# EAGLE schematic power distribution pcb (EAGLE 6.2)
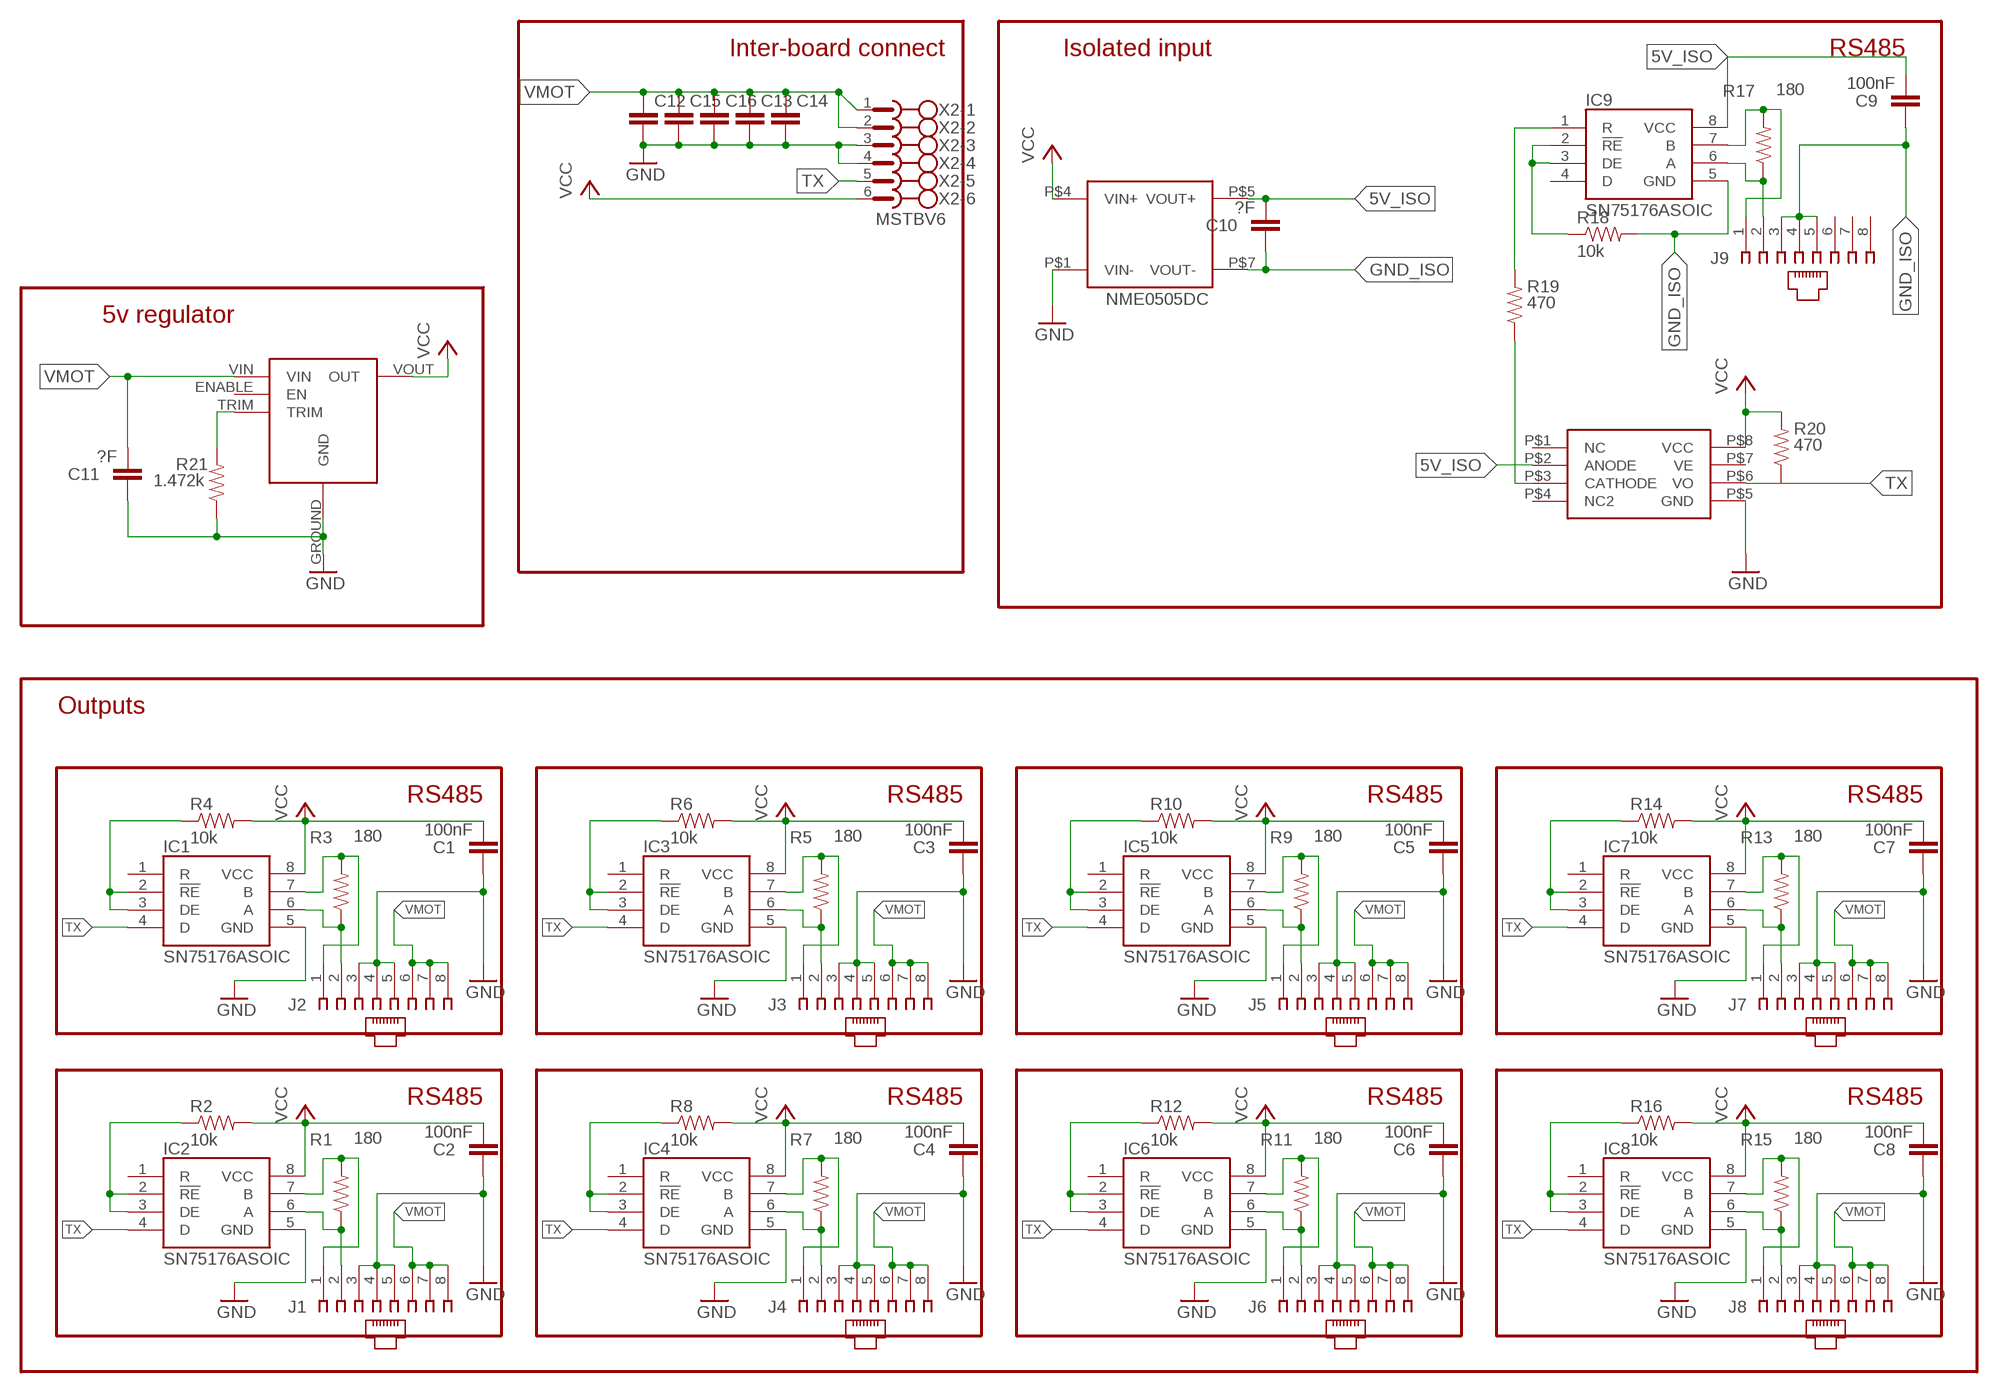
[diagram p0: schematic, sheet 1]

## Parts
C1  100nF  CAP0805  [0805]
C2  100nF  CAP0805  [0805]
C3  100nF  CAP0805  [0805]
C4  100nF  CAP0805  [0805]
C5  100nF  CAP0805  [0805]
C6  100nF  CAP0805  [0805]
C7  100nF  CAP0805  [0805]
C8  100nF  CAP0805  [0805]
C9  100nF  CAP0805  [0805]
C10  ?F  CAP0805  [0805]
C11  ?F  CAP0805  [0805]
C12  CAP1210  [1210]
C13  CAP1210  [1210]
C14  CAP1210  [1210]
C15  CAP1210  [1210]
C16  CAP1210  [1210]
IC1  SN75176ASOIC  [SO08]
IC2  SN75176ASOIC  [SO08]
IC3  SN75176ASOIC  [SO08]
IC4  SN75176ASOIC  [SO08]
IC5  SN75176ASOIC  [SO08]
IC6  SN75176ASOIC  [SO08]
IC7  SN75176ASOIC  [SO08]
IC8  SN75176ASOIC  [SO08]
IC9  SN75176ASOIC  [SO08]
J1  520426-4  [520426-4]
J2  520426-4  [520426-4]
J3  520426-4  [520426-4]
J4  520426-4  [520426-4]
J5  520426-4  [520426-4]
J6  520426-4  [520426-4]
J7  520426-4  [520426-4]
J8  520426-4  [520426-4]
J9  520426-4  [520426-4]
R1  180  RESISTOR  [0805]
R2  10k  RESISTOR  [0805]
R3  180  RESISTOR  [0805]
R4  10k  RESISTOR  [0805]
R5  180  RESISTOR  [0805]
R6  10k  RESISTOR  [0805]
R7  180  RESISTOR  [0805]
R8  10k  RESISTOR  [0805]
R9  180  RESISTOR  [0805]
R10  10k  RESISTOR  [0805]
R11  180  RESISTOR  [0805]
R12  10k  RESISTOR  [0805]
R13  180  RESISTOR  [0805]
R14  10k  RESISTOR  [0805]
R15  180  RESISTOR  [0805]
R16  10k  RESISTOR  [0805]
R17  180  RESISTOR  [0805]
R18  10k  RESISTOR  [0805]
R19  470  RESISTOR  [0805]
R20  470  RESISTOR  [0805]
R21  1.472k  RESISTOR  [0805]
U$1  NME0505DC  [NME0505DC]
U$2  OKI-T/3-W40N-C  [OKI-T/3-W40N-C]
U$3  6N137  [8_SOIC]
X2  MSTBV6  [MSTBV6]

## Nets
5V_ISO: C9.2 C10.2 IC9.8(VCC) U$1.P$5(VOUT+) U$3.P$2(ANODE)
D1: IC1.2(!RE) IC1.3(DE) R4.1
D2: IC2.2(!RE) IC2.3(DE) R2.1
D3: IC3.2(!RE) IC3.3(DE) R6.1
D4: IC4.2(!RE) IC4.3(DE) R8.1
D5: IC5.2(!RE) IC5.3(DE) R10.1
D6: IC6.2(!RE) IC6.3(DE) R12.1
D7: IC7.2(!RE) IC7.3(DE) R14.1
D8: IC8.2(!RE) IC8.3(DE) R16.1
D9: IC9.2(!RE) IC9.3(DE) R18.1
GND [power]: C1.1 C2.1 C3.1 C4.1 C5.1 C6.1 C7.1 C8.1 C11.1 C12.2 C13.2 C14.2 C15.2 C16.2 IC1.5(GND) IC2.5(GND) IC3.5(GND) IC4.5(GND) IC5.5(GND) IC6.5(GND) IC7.5(GND) IC8.5(GND) J1.3 J1.4 J1.5 J2.3 J2.4 J2.5 J3.3 J3.4 J3.5 J4.3 J4.4 J4.5 J5.3 J5.4 J5.5 J6.3 J6.4 J6.5 J7.3 J7.4 J7.5 J8.3 J8.4 J8.5 R21.1 U$1.P$1(VIN-) U$2.GROUND(GND) U$3.P$5(GND) X2.3 X2.4
GND_ISO: C9.1 C10.1 IC9.5(GND) J9.3 J9.4 J9.5 R18.2 U$1.P$7(VOUT-)
N$1: R19.1 U$3.P$3(CATHODE)
N$3: IC9.1(R) R19.2
N$9: R21.2 U$2.TRIM
RS485A1: IC1.6(A) J2.2 R3.1
RS485A2: IC2.6(A) J1.2 R1.1
RS485A3: IC3.6(A) J3.2 R5.1
RS485A4: IC4.6(A) J4.2 R7.1
RS485A5: IC5.6(A) J5.2 R9.1
RS485A6: IC6.6(A) J6.2 R11.1
RS485A7: IC7.6(A) J7.2 R13.1
RS485A8: IC8.6(A) J8.2 R15.1
RS485A9: IC9.6(A) J9.2 R17.1
RS485B1: IC1.7(B) J2.1 R3.2
RS485B2: IC2.7(B) J1.1 R1.2
RS485B3: IC3.7(B) J3.1 R5.2
RS485B4: IC4.7(B) J4.1 R7.2
RS485B5: IC5.7(B) J5.1 R9.2
RS485B6: IC6.7(B) J6.1 R11.2
RS485B7: IC7.7(B) J7.1 R13.2
RS485B8: IC8.7(B) J8.1 R15.2
RS485B9: IC9.7(B) J9.1 R17.2
TX: IC1.4(D) IC2.4(D) IC3.4(D) IC4.4(D) IC5.4(D) IC6.4(D) IC7.4(D) IC8.4(D) R20.1 U$3.P$6(VO) X2.5
VCC: C1.2 C2.2 C3.2 C4.2 C5.2 C6.2 C7.2 C8.2 IC1.8(VCC) IC2.8(VCC) IC3.8(VCC) IC4.8(VCC) IC5.8(VCC) IC6.8(VCC) IC7.8(VCC) IC8.8(VCC) R2.2 R4.2 R6.2 R8.2 R10.2 R12.2 R14.2 R16.2 R20.2 U$1.P$4(VIN+) U$2.VOUT(OUT) U$3.P$8(VCC) X2.6
VMOT: C11.2 C12.1 C13.1 C14.1 C15.1 C16.1 J1.6 J1.7 J1.8 J2.6 J2.7 J2.8 J3.6 J3.7 J3.8 J4.6 J4.7 J4.8 J5.6 J5.7 J5.8 J6.6 J6.7 J6.8 J7.6 J7.7 J7.8 J8.6 J8.7 J8.8 U$2.VIN X2.1 X2.2
Unconnected: IC1.1(R) IC2.1(R) IC3.1(R) IC4.1(R) IC5.1(R) IC6.1(R) IC7.1(R) IC8.1(R) IC9.4(D) J9.6 J9.7 J9.8 U$2.ENABLE(EN) U$3.P$1(NC) U$3.P$4(NC2) U$3.P$7(VE)

## Notes on the sheet
- Inter-board connect | Isolated input | RS485
- 5v regulator
- Outputs
- RS485 | RS485 | RS485 | RS485
- RS485 | RS485 | RS485 | RS485

## Library data of the parts
C1-C16 = SparkFun:CAP: Capacitor Standard 0603 ceramic capacitor, and 0.1" leaded capacitor.
IC1-IC9 = reprap:SN75176A
J1-J9 = con-amp:520426-4: AMP connector
R1-R21 = SparkFun:RESISTOR: Resistor Basic schematic elements and footprints for 0603, 1206, and PTH 1/10th watt (small) resistors.
U$1 = sonos_library:NME0505DC
U$2 = sonos_library:OKI-T/3-W40N-C
U$3 = sonos_library:6N137
X2 = con-phoenix-508:MSTBV6: PHOENIX; MPN: MSTBV 2,5/6-GF-5.08; OC_FARNELL: 1792796; OC_NEWARK: 69R9849

## Net classes
0 default: width 0.305 mm
1 power: width 0.406 mm
2 motors: width 0.61 mm